# Altium schematic sheet Main_sch.SchDoc
size A4; SheetNumber: 1; SheetTotal: 9
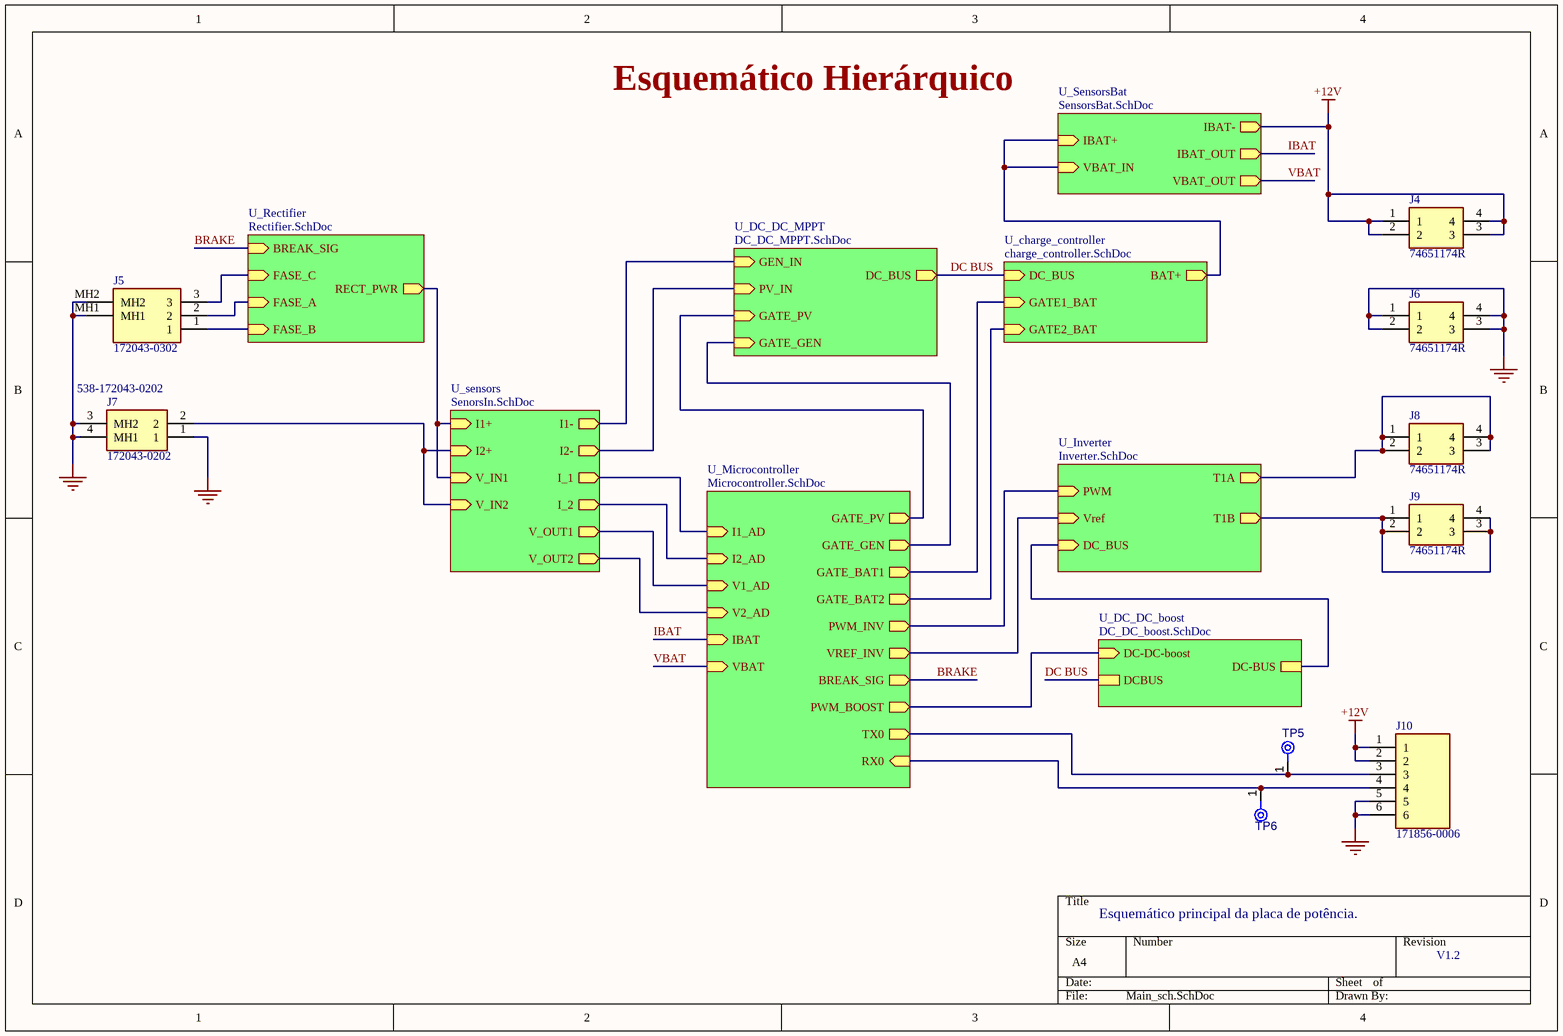
[diagram p0: Main_sch.SchDoc]

## Parts
J4  74651174R  [74651174R]
J5  172043-0302  [1720430302]
J6  74651174R  [74651174R]
J7  172043-0202  Supplier Part Number 1: 538-172043-0202  [1720430202]
J8  74651174R  [74651174R]
J9  74651174R  [74651174R]
J10  171856-0006  [HDRV6W99P0X254_1X6_1509X635X1100P]
TP5  TPAD6R  [TP06R]  (value not drawn)  (no BOM)
TP6  TPAD6R  [TP06R]  (value not drawn)  (no BOM)

## Sub-sheets
U_charge_controller = charge_controller.SchDoc: GATE1_BAT (in), GATE2_BAT (in), DC_BUS (in), BAT+ (out)
U_DC_DC_boost = DC_DC_boost.SchDoc: DC-DC-boost (in), DCBUS, DC-BUS
U_DC_DC_MPPT = DC_DC_MPPT.SchDoc: GATE_PV (in), PV_IN (in), GEN_IN (in), GATE_GEN (in), DC_BUS (out)
U_Inverter = Inverter.SchDoc: PWM (in), Vref (in), T1A (out), T1B (out), DC_BUS (in)
U_Microcontroller = Microcontroller.SchDoc: TX0 (out), RX0 (in), I1_AD (in), I2_AD (in), V1_AD (in), V2_AD (in), GATE_PV (out), GATE_GEN (out), IBAT (in), VBAT (in), GATE_BAT1 (out), GATE_BAT2 (out), BREAK_SIG (out), PWM_INV (out), VREF_INV (out), PWM_BOOST (out)
U_Rectifier = Rectifier.SchDoc: BREAK_SIG (in), FASE_C (in), FASE_A (in), FASE_B (in), RECT_PWR (out)
U_sensors = SenorsIn.SchDoc: I_2 (out), I_1 (out), V_IN1 (in), V_IN2 (in), V_OUT2 (out), V_OUT1 (out), I1- (out), I2- (out), I2+ (in), I1+ (in)
U_SensorsBat = SensorsBat.SchDoc: IBAT+ (in), IBAT- (out), IBAT_OUT (out), VBAT_IN (in), VBAT_OUT (out)

## Nets
+12V: J4.1 J4.2 J4.3 J4.4 J10.1 J10.2 ; sheet U_SensorsBat/IBAT-
GND: J5.MH1 J5.MH2 J6.1 J6.2 J6.3 J6.4 J7.1 J7.3(MH2) J7.4(MH1) J10.5 J10.6
BRAKE: sheet U_Rectifier/BREAK_SIG, sheet U_Microcontroller/BREAK_SIG
DC BUS: sheet U_DC_DC_MPPT/DC_BUS, sheet U_charge_controller/DC_BUS, sheet U_DC_DC_boost/DCBUS
IBAT: sheet U_Microcontroller/IBAT, sheet U_SensorsBat/IBAT_OUT
VBAT: sheet U_Microcontroller/VBAT, sheet U_SensorsBat/VBAT_OUT
NetJ5_1: J5.1 ; sheet U_Rectifier/FASE_B
NetJ5_2: J5.2 ; sheet U_Rectifier/FASE_A
NetJ5_3: J5.3 ; sheet U_Rectifier/FASE_C
NetJ7_2: J7.2 ; sheet U_sensors/V_IN2, sheet U_sensors/I2+
NetJ8_1: J8.1 J8.2 J8.3 J8.4 ; sheet U_Inverter/T1A
NetJ9_1: J9.1 J9.2 J9.3 J9.4 ; sheet U_Inverter/T1B
NetJ10_3: J10.3 TP5.1(TP) ; sheet U_Microcontroller/TX0
NetJ10_4: J10.4 TP6.1(TP) ; sheet U_Microcontroller/RX0
(unnamed): sheet U_Rectifier/RECT_PWR, sheet U_sensors/V_IN1, sheet U_sensors/I1+
(unnamed): sheet U_DC_DC_MPPT/GATE_PV, sheet U_Microcontroller/GATE_PV
(unnamed): sheet U_DC_DC_MPPT/PV_IN, sheet U_sensors/I2-
(unnamed): sheet U_DC_DC_MPPT/GEN_IN, sheet U_sensors/I1-
(unnamed): sheet U_DC_DC_MPPT/GATE_GEN, sheet U_Microcontroller/GATE_GEN
(unnamed): sheet U_sensors/I_2, sheet U_Microcontroller/I2_AD
(unnamed): sheet U_sensors/I_1, sheet U_Microcontroller/I1_AD
(unnamed): sheet U_sensors/V_OUT2, sheet U_Microcontroller/V2_AD
(unnamed): sheet U_sensors/V_OUT1, sheet U_Microcontroller/V1_AD
(unnamed): sheet U_Microcontroller/GATE_BAT1, sheet U_charge_controller/GATE1_BAT
(unnamed): sheet U_Microcontroller/GATE_BAT2, sheet U_charge_controller/GATE2_BAT
(unnamed): sheet U_Microcontroller/PWM_INV, sheet U_Inverter/PWM
(unnamed): sheet U_Microcontroller/VREF_INV, sheet U_Inverter/Vref
(unnamed): sheet U_Microcontroller/PWM_BOOST, sheet U_DC_DC_boost/DC-DC-boost
(unnamed): sheet U_Inverter/DC_BUS, sheet U_DC_DC_boost/DC-BUS
(unnamed): sheet U_SensorsBat/IBAT+, sheet U_SensorsBat/VBAT_IN, sheet U_charge_controller/BAT+

## Notes on the sheet
- Esquemático Hierárquico
- Esquemático principal da placa de potência.
- V1.2

## Library data of the parts
J4 J6 J8 J9 = 74651174R: SHANK, THR; Manufacturer_Name: Wurth Elektronik; Manufacturer: Wurth Electronics; Current Rating: 50A; Datasheet Link: https://componentsearchengine.com/Datasheets/1/74651174R.pdf; Height: 11mm; Manufacturer_Part_Number: 74651174R; Mouser Part Number: 710-74651174R; Mouser Price/Stock: https://www.mouser.co.uk/ProductDetail/Wurth-Elektronik/74651174R?qs=lBTPRtX1sU9uJ5vjuYZPZA%3D%3D; Supplier 1: Mouser; Supplier Part Number 1: 710-74651174R; Manufacturer Part Number: 74651174R; RoHS: Yes; Category: Terminals; Stock 1: 997; Pricing 1: 1=3.26000, 10=3.02000, 50=2.71000, 100=2.45000, 1000=2.06000, 10000=2.06000 (USD); Mount: Through Hole; Number of Pins: 4; Contact Plating: Tin; Contact Material: Brass; Termination: Solder; RoHS Compliant: Yes; ComponentLink1URL: http://katalog.we-online.de/em/datasheet/74651174R.pdf?src-supplier=Digi-Key; ComponentLink1Description: http://katalog.we-online.de/em/datasheet/74651174R.pdf?src-supplier=Digi-Key; ComponentLink2URL: https://katalog.we-online.de/em/datasheet/74651174R.pdf?src-supplier=Digi-Key; ComponentLink2Description: https://katalog.we-online.de/em/datasheet/74651174R.pdf?src-supplier=Digi-Key
J5 = 172043-0302: Conn Power HDR 3 POS 7.49mm Solder RA Thru-Hole 3 Terminal 1 Port Super Sabre™ Frame; Manufacturer_Name: Molex; Number of Positions: 3; Voltage Rating: 600V; Current Rating: 30A; Pitch: 0.295inch; Glow Wire Compliant: Compliant; Datasheet Link: https://www.molex.com/pdm_docs/sd/1720430401_sd.pdf; Height: 11.53mm; Manufacturer_Part_Number: 172043-0302; ComponentLink1URL: http://www.molex.com/pdm_docs/sd/1720430202_sd.pdf?src-supplier=Avnet; ComponentLink1Description: http://www.molex.com/pdm_docs/sd/1720430202_sd.pdf?src-supplier=Avnet; ComponentLink2URL: http://www.molex.com/pdm_docs/sd/1720430302_sd.pdf?src-supplier=Digi-Key; ComponentLink2Description: http://www.molex.com/pdm_docs/sd/1720430302_sd.pdf?src-supplier=Digi-Key; ComponentLink3URL: https://www.molex.com/pdm_docs/sd/1720430302_sd.pdf?src-supplier=Digi-Key; ComponentLink3Description: https://www.molex.com/pdm_docs/sd/1720430302_sd.pdf?src-supplier=Digi-Key; ComponentLink4URL: https://www.mouser.com/ds/2/276/1720430202_PCB_HEADERS-704499.pdf?src-supplier=Mouser; ComponentLink4Description: https://www.mouser.com/ds/2/276/1720430202_PCB_HEADERS-704499.pdf?src-supplier=Mouser; ComponentLink5URL: http://www.literature.molex.com/SQLImages/kelmscott/Molex/PDF_Images/987650-1349.PDF?src-supplier=Digi-Key; ComponentLink5Description: http://www.literature.molex.com/SQLImages/kelmscott/Molex/PDF_Images/987650-1349.PDF?src-supplier=Digi-Key; ComponentLink6URL: http://www.molex.com/pdm_docs/sd/1720430202_sd.pdf?src-supplier=Digi-Key; ComponentLink6Description: http://www.molex.com/pdm_docs/sd/1720430202_sd.pdf?src-supplier=Digi-Key; Supplier 1: Mouser; Supplier Part Number 1: 538-172043-0302; Manufacturer: Molex; Manufacturer Part Number: 1720430302; RoHS: Yes; Category: Headers and Wire Housings; Stock 1: 770; Pricing 1: 1=4.13000, 10=3.64000, 50=3.64000, 100=2.90000, 1000=2.39000, 10000=2.23000 (USD); Mount: Through Hole; Number of Pins: 3; Color: Black; Contact Material: Copper; Contact Plating: Silver; Insulation Material: Polymer; Min Operating Temperature: -40°C; Max Operating Temperature: 125°C; Packaging: Tray; Number of Rows: 1; Termination: Solder; Fastening Type: Ramp; Orientation: Right Angle; Number of Circuits: 3; Halogen Free: Low Halogen; RoHS Compliant: Yes
J7 = 172043-0202: CONN HDR 2POS 7.50MM R/A SLDR; Manufacturer_Name: Molex; Number of Positions: 2; Voltage Rating: 600V; Current Rating: 30A; Pitch: 0.295inch; Datasheet Link: https://www.molex.com/pdm_docs/sd/1720430202_sd.pdf; Height: 11.68mm; Manufacturer_Part_Number: 172043-0202; Mouser Part Number: 538-172043-0202; Mouser Price/Stock: https://www.mouser.co.uk/ProductDetail/Molex/172043-0202?qs=AUG1J5sL7zJwcA2Oseq0RA%3D%3D; Supplier 1: Mouser; Manufacturer: Molex; Manufacturer Part Number: 1720430202; RoHS: Yes; Category: Cables and Wire; Stock 1: 939; Pricing 1: 1=2.21000, 10=1.89000, 50=1.89000, 100=1.56000, 1000=1.22000, 10000=1.08000 (USD); Mount: Through Hole; Number of Pins: 2; Color: Black; Contact Material: Copper; Contact Plating: Silver; Insulation Material: Polymer; Min Operating Temperature: -40°C; Max Operating Temperature: 125°C; Packaging: Tray; Number of Rows: 1; Termination: Solder; Fastening Type: Ramp; Orientation: Right Angle; Number of Circuits: 2; RoHS Compliant: Yes; ComponentLink1URL: https://www.mouser.com/ds/2/276/1720430202_PCB_HEADERS-704499.pdf?src-supplier=Mouser; ComponentLink1Description: https://www.mouser.com/ds/2/276/1720430202_PCB_HEADERS-704499.pdf?src-supplier=Mouser; ComponentLink2URL: http://www.molex.com/pdm_docs/sd/1720430202_sd.pdf?src-supplier=Avnet; ComponentLink2Description: http://www.molex.com/pdm_docs/sd/1720430202_sd.pdf?src-supplier=Avnet; ComponentLink3URL: http://www.literature.molex.com/SQLImages/kelmscott/Molex/PDF_Images/987650-1349.PDF?src-supplier=Digi-Key; ComponentLink3Description: http://www.literature.molex.com/SQLImages/kelmscott/Molex/PDF_Images/987650-1349.PDF?src-supplier=Digi-Key; ComponentLink4URL: http://www.molex.com/pdm_docs/sd/1720430202_sd.pdf?src-supplier=Digi-Key; ComponentLink4Description: http://www.molex.com/pdm_docs/sd/1720430202_sd.pdf?src-supplier=Digi-Key
J10 = 171856-0006: Conn Wire to Board HDR 6 POS 2.54mm Solder ST Thru-Hole KK® Bag; Manufacturer_Name: Molex; Current Rating: 4A; Voltage Rating: 250V; Number of Positions: 6; Gender: Male; Connector Type: Male Pin; Contact Post Length: 2.34mm; Glow Wire Compliant: Compliant; Datasheet Link: https://www.molex.com/pdm_docs/sd/1718560006_sd.pdf; Height: 11mm; Manufacturer_Part_Number: 171856-0006; Mouser Part Number: 538-171856-0006; Mouser Price/Stock: https://www.mouser.co.uk/ProductDetail/Molex/171856-0006?qs=s7UCm7gO1bZ%2FF4kPA9T7bA%3D%3D; Supplier 1: Mouser; Supplier Part Number 1: 538-171856-0006; Manufacturer: Molex; Manufacturer Part Number: 171856-0006; RoHS: Yes; Category: Headers and Wire Housings; Stock 1: 7773; Pricing 1: 1=0.52000, 10=0.44100, 50=0.44100, 100=0.34400, 1000=0.27000, 10000=0.22000 (USD); Mount: Through Hole; Contact Plating: Tin,Matte; Contact Material: Brass,Tin; Color: Black; Housing Color: Black; Housing Material: Nylon; Weight: 0.023916oz; Min Operating Temperature: -40°C; Max Operating Temperature: 105°C; Number of Rows: 1; Contact Gender: Male; Packaging: Bulk; Package Quantity: 2000; Fastening Type: Friction; Termination: Solder; Number of Contacts: 6; Orientation: Vertical; Number of Circuits: 6; Length: 15.09mm; Pitch: 2.54mm; Contact Mating Length: 0.293inch; Depth: 6.35mm; Radiation Hardening: No; REACH SVHC: Unknown; Halogen Free: Low Halogen; Flammability Rating: UL94 V-2; RoHS Compliant: Yes; ComponentLink1URL: https://datasheet.ciiva.com/24135/1718560006-pcb-headers-295618-24135976.pdf?src-supplier=Mouser; ComponentLink1Description: https://datasheet.ciiva.com/24135/1718560006-pcb-headers-295618-24135976.pdf?src-supplier=Mouser; ComponentLink2URL: https://datasheet.ciiva.com/30069/162461718560006-pcb-headers-30069863.pdf?src-supplier=Onlinecomponents.com; ComponentLink2Description: https://datasheet.ciiva.com/30069/162461718560006-pcb-headers-30069863.pdf?src-supplier=Onlinecomponents.com; ComponentLink3URL: https://datasheet.ciiva.com/28500/1769843-28500365.pdf?src-supplier=Element14; ComponentLink3Description: https://datasheet.ciiva.com/28500/1769843-28500365.pdf?src-supplier=Element14; ComponentLink4URL: https://datasheet.ciiva.com/30492/0900766b8129e59b-30492739.pdf?src-supplier=RSComponents; ComponentLink4Description: https://datasheet.ciiva.com/30492/0900766b8129e59b-30492739.pdf?src-supplier=RSComponents; ComponentLink5URL: https://datasheet.ciiva.com/29948/1718560002-sd-29948527.pdf?src-supplier=Avnet; ComponentLink5Description: https://datasheet.ciiva.com/29948/1718560002-sd-29948527.pdf?src-supplier=Avnet; ComponentLink6URL: https://datasheet.ciiva.com/30514/70314281-30514598.pdf?src-supplier=Allied+Electronics; ComponentLink6Description: https://datasheet.ciiva.com/30514/70314281-30514598.pdf?src-supplier=Allied+Electronics
TP5 TP6 = CMP-00028-00002-2: 0.6mm round; Pins: 1